# Altium schematic sheet 4_PowerSupplie.SchDoc
size 414 x 293 mm; SheetNumber: 4; SheetTotal: 4; PageSetup: Record=PageOptionsZCenterHorizontal=TrueZCenterVertical=TrueZPrintScale=1.00ZXCorrection=0.00ZYCorrection=0.00ZPrintKind=1ZBorderSize=5000000ZLeftOffset=0ZBottomOffset=0ZOrientation=2ZPaperLength=1000ZPaperWidth=1000ZScale=100ZPaperSource=7ZPrintQuality=-4ZMediaType=1ZDitherType=10ZPaperKind=A3ZPrintScaleMode=0; Razrabotal: {Разработал}; Proveril: {Проверил}; Tkontr: {Т.контр.}; Nkontr: {Н.контр.}; Ytverdil: {Утвердил}; Nazvanie1: {Название1}; Nazvanie2: {Название2}; Oboznachenie: {Обозначение}
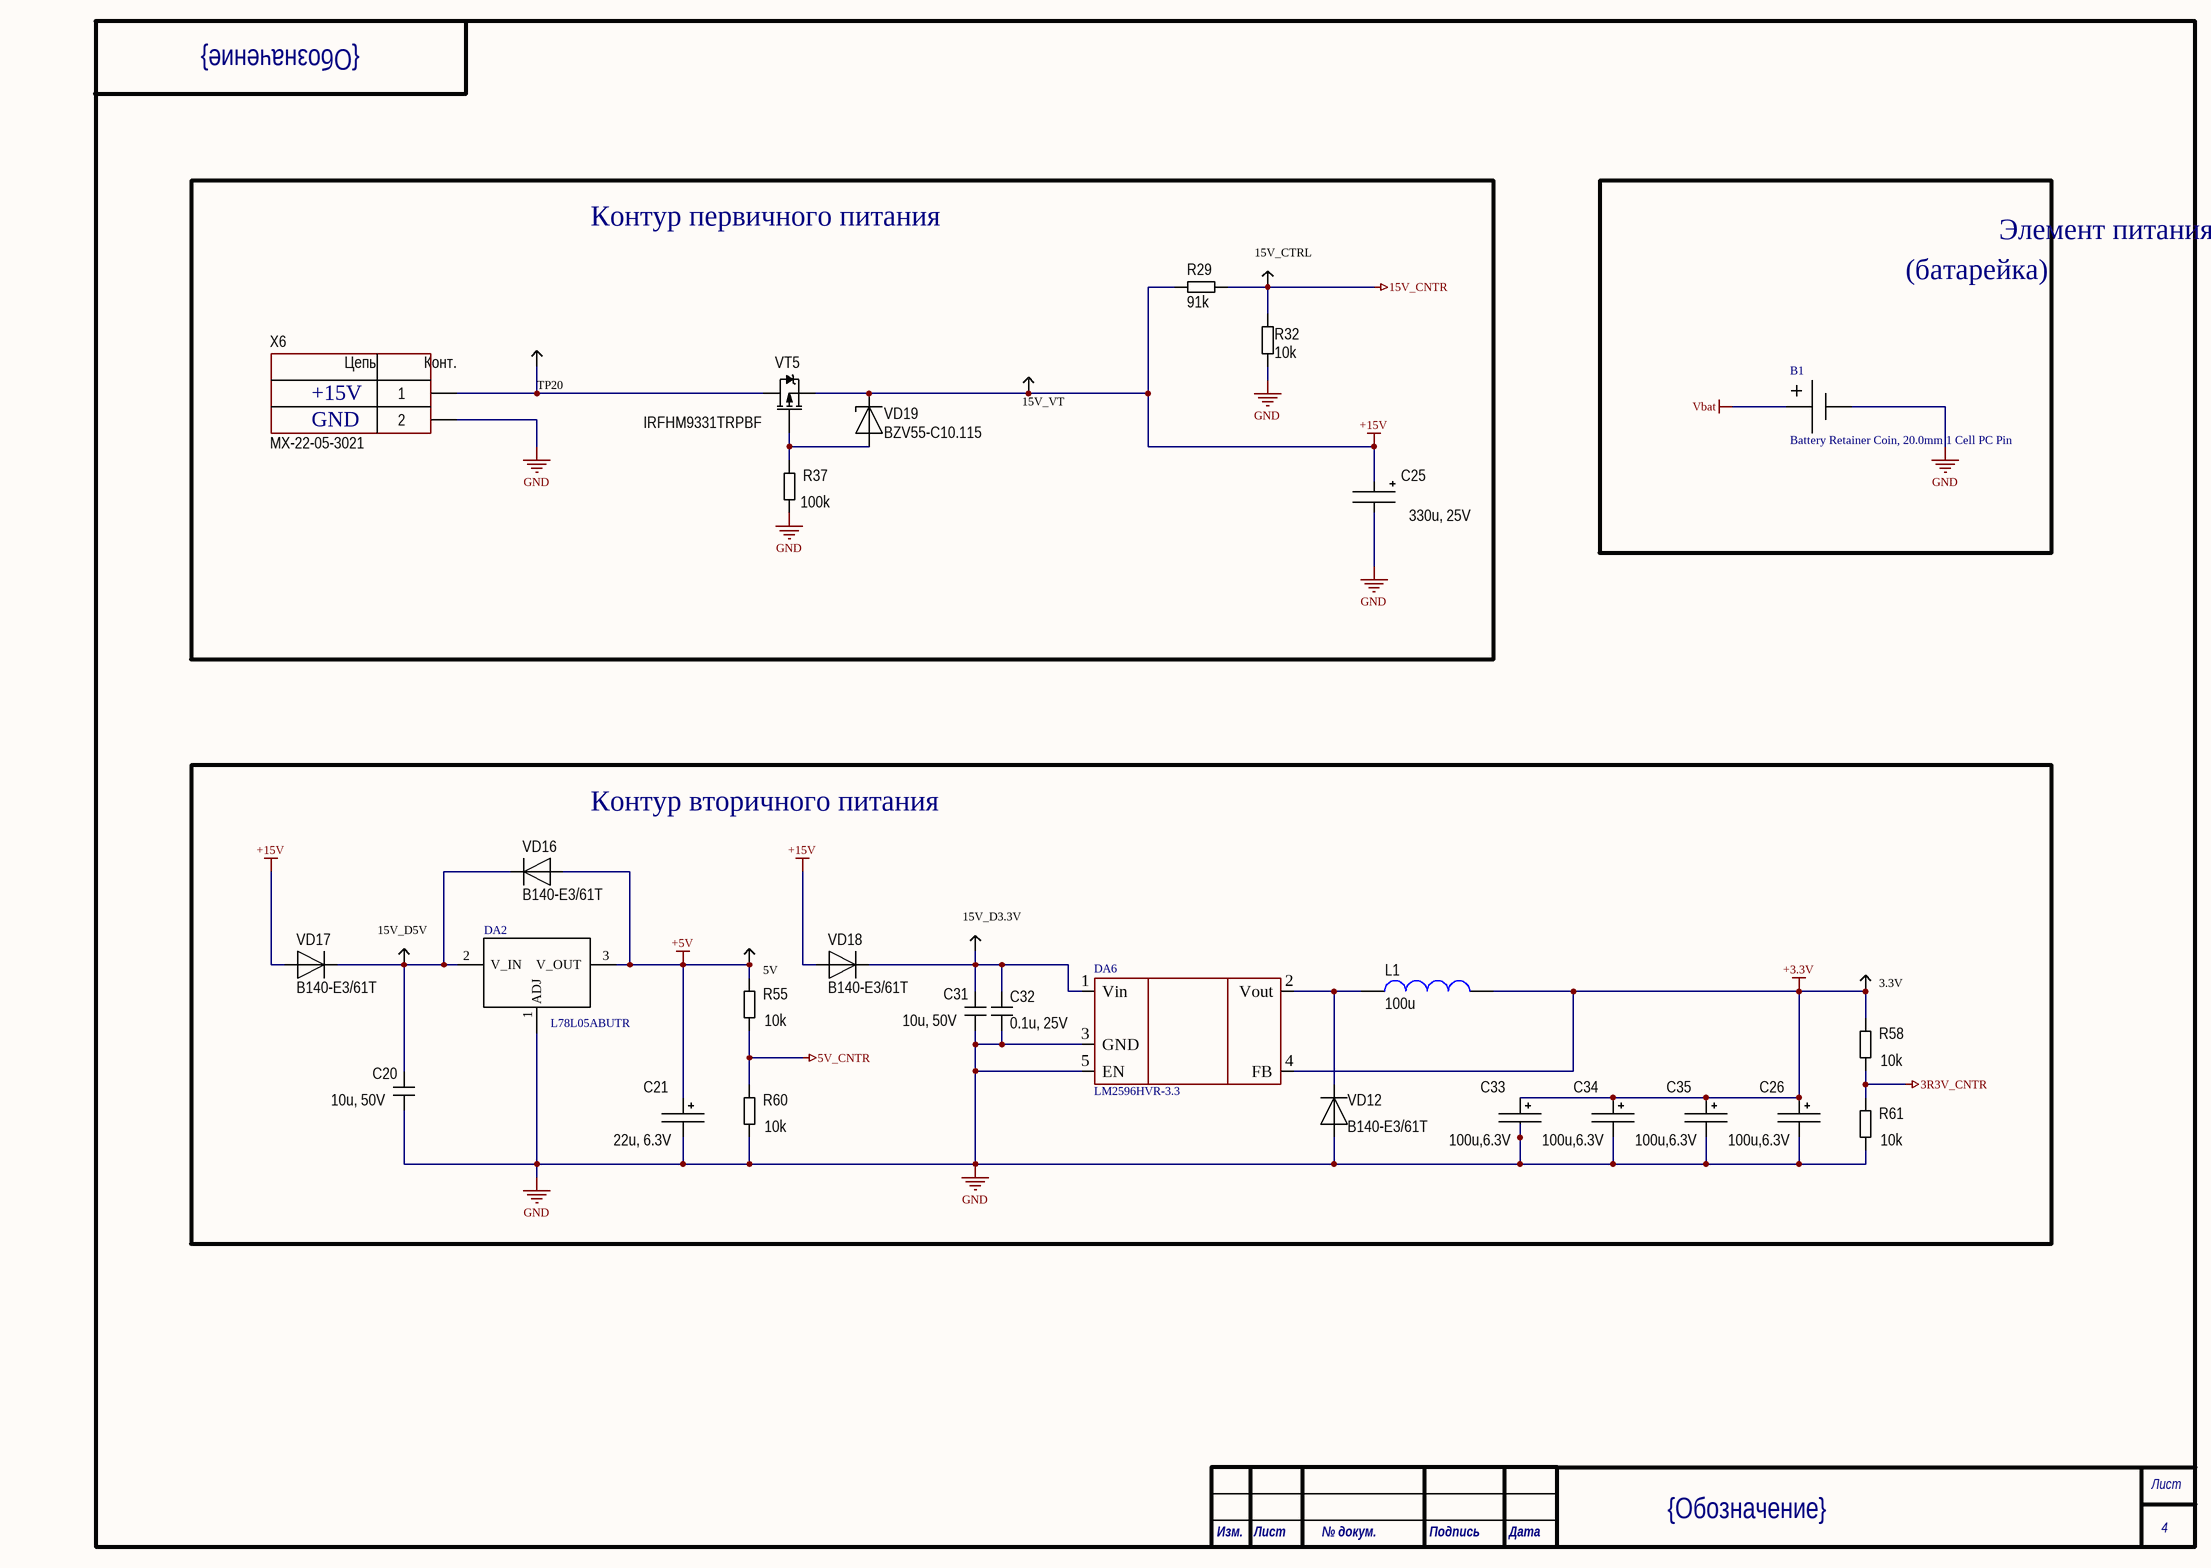
[diagram p0: 4_PowerSupplie.SchDoc]

## Parts
3.3V  (no value)  [TestPoint]
5V  (no value)  [TestPoint]
15V_CTRL  (no value)  [TestPoint]
15V_D3.3V  (no value)  [TestPoint]
15V_D5V  (no value)  [TestPoint]
15V_VT  (no value)  [TestPoint]
B1  Battery Retainer Coin, 20.0mm 1 Cell PC Pin  [BAT: CR2032_SM]
C20  10u, 50V  [CH1206C]
C21  22u, 6.3V  [TANTAL_A]
C25  330u, 25V  [D10C4.4H10]
C26  100u,6.3V  [TANTAL_C]
C31  10u, 50V  [CH1206C]
C32  0.1u, 25V  [CH0603C]
C33  100u,6.3V  [TANTAL_C]
C34  100u,6.3V  [TANTAL_C]
C35  100u,6.3V  [TANTAL_C]
DA2  L78L05ABUTR  [SOT89_PC12120]
DA6  LM2596HVR-3.3  [TO263S-5+1]
L1  100u  [IND: B82477G4]
R29  91k  [CH0402R]
R32  10k  [CH0402R]
R37  100k  [CH0402R]
R55  10k  [CH0402R]
R58  10k  [CH0402R]
R60  10k  [CH0402R]
R61  10k  [CH0402R]
TP20  (no value)  [TestPoint]
VD12  B140-E3/61T  [SMA]
VD16  B140-E3/61T  [SMA]
VD17  B140-E3/61T  [SMA]
VD18  B140-E3/61T  [SMA]
VD19  BZV55-C10.115  [SOD80]
VT5  IRFHM9331TRPBF  [PQFN-3x3]
X6  MX-22-05-3021  [CON: MX-22-05-3021]

## Blocks framed on the sheet
Контур первичного питания: 15V_CTRL 15V_VT C25 R29 R32 R37 TP20 VD19 VT5 X6
Контур вторичного питания: 3.3V 5V 15V_D3.3V 15V_D5V C20 C21 C26 C31-C35 DA2 DA6 L1 R55 R58 R60 R61 VD12 VD16-VD18

## Nets
3R3V_CNTR: R58.1 R61.2
5V_CNTR: R55.1 R60.2
15V_CNTR: 15V_CTRL.0 R29.1 R32.1
+3.3V: 3.3V.0 C26.1 C33.1 C34.1 C35.1 DA6.4(FB) L1.1 R58.2
+5V: 5V.0 C21.1 DA2.3(V_OUT) R55.2 VD16.1
+15V: 15V_VT.0 C25.1 R29.2 VD17.1 VD18.1 VD19.2(C) VT5.3(S)
GND: B1.2 C20.1 C21.2 C25.2 C26.2 C31.1 C32.1 C33.2 C34.2 C35.2 DA2.1(ADJ) DA6.3(GND) DA6.5(EN) R32.2 R37.1 R60.1 R61.1 VD12.1 X6.2
Vbat: B1.1
Net15V_D3.3V_0: 15V_D3.3V.0 C31.2 C32.2 DA6.1(Vin) VD18.2
Net15V_D5V_0: 15V_D5V.0 C20.2 DA2.2(V_IN) VD16.2 VD17.2
NetDA6_2: DA6.2(Vout) L1.2 VD12.2
NetR37_2: R37.2 VD19.1(A) VT5.1(G)
NetTP20_0: TP20.0 VT5.2(D) X6.1

## Notes on the sheet
- (батарейка)
- Элемент питания CR2032
- +15V
- GND
- Лист
- Изм.
- № докум.
- Подпись
- Дата
- (in symbol 2-Connector) Цепь; Конт.

## Library data of the parts
3.3V 5V 15V_CTRL 15V_D3.3V 15V_D5V 15V_VT TP20 = TestPoint: Model: DNP
B1 = Battery_CR2032: Battery Retainer Coin, 20.0mm 1 Cell PC Pin, Keystone Electronics; Model: 3044; Parameter 1: *
C20 C31 = Capacitor: Model: CL31B106KBHNNNE; Manufacturer: *; HelpURL: *; ComponentKind: *; Value: *
C21 = TantalCap: Model: T494A226M010AT; Manufacturer: *; HelpURL: *; ComponentKind: *; Value: *
C25 = AlumCap: Model: EEE-FT1H331AP; Manufacturer: *; HelpURL: *; ComponentKind: *; Value: *
C26 C33-C35 = TantalCap: Model: 593D107X9010C2TE3; Manufacturer: *; HelpURL: *; ComponentKind: *; Value: *
C32 = Capacitor: Model: 06035C104KAT2A; Manufacturer: *; HelpURL: *; ComponentKind: *; Value: 0.1u, 25V
DA2 = LM1117: Model: L78L05ABUTR
DA6 = LM2575HV: Model: LM2596HVR-3.3
L1 = Inductor: Model: B82477G4104M000; Manufacturer: *; HelpURL: *; ComponentKind: *; Value: 100u
R29 = Resistor: Model: AC0402FR-0791KL; Manufacturer: *; HelpURL: *; ComponentKind: *; Value: *
R32 R55 R58 R60 R61 = Resistor: Model: AC0402FR-0710KL; Manufacturer: *; HelpURL: *; ComponentKind: *; Value: *
R37 = Resistor: Model: AC0402FR-07100KL; Manufacturer: *; HelpURL: *; ComponentKind: *; Value: *
VD12 VD16-VD18 = Diod: ComponentKind: *; Manufacturer: *; Model: B140-E3/61T; HelpURL: *
VD19 = Diod Zener: ComponentKind: *; Manufacturer: *; Model: BZV55-C10.115; HelpURL: *
VT5 = P-chanel: Mosfet; Model: IRFHM9331TRPBF; Manufacturer: *; ComponentKind: *; HelpURL: *
X6 = 2-Connector: Model: MX-22-05-3021; Manufacturer: *; HelpURL: *; ComponentKind: *